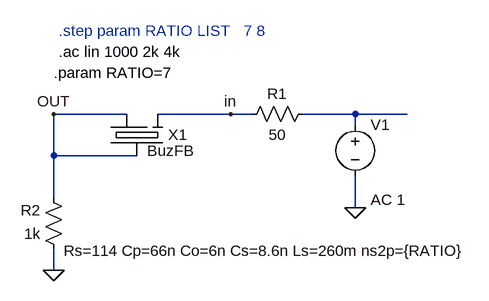
[diagram p0: schematic input_short.asc]
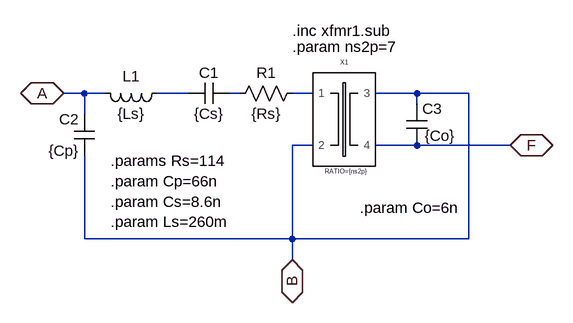
[diagram p1: sub-circuit buzfb.asc]
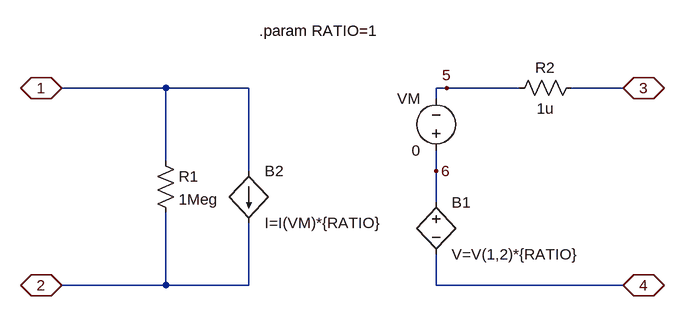
[diagram p2: sub-circuit xmfr1.asc]
input_short.asc, the LTspice schematic file:
Version 4
SHEET 1 3040 2984
WIRE 1712 2608 1600 2608
WIRE 1872 2608 1760 2608
WIRE 1904 2608 1872 2608
WIRE 2064 2608 1984 2608
WIRE 2144 2608 2064 2608
WIRE 2064 2624 2064 2608
WIRE 1600 2672 1600 2608
WIRE 1728 2672 1600 2672
WIRE 1600 2736 1600 2672
WIRE 2064 2752 2064 2704
WIRE 1600 2848 1600 2816
FLAG 1600 2848 0
FLAG 2064 2752 0
FLAG 1600 2608 OUT
FLAG 1872 2608 in
SYMBOL VOLTAGE 2064 2608 R0
WINDOW 123 24 132 Left 2
WINDOW 39 0 0 Left 2
SYMATTR Value2 AC 1
SYMATTR InstName V1
SYMATTR Value ""
SYMBOL res 2000 2592 R90
WINDOW 0 0 56 VBottom 2
WINDOW 3 32 56 VTop 2
SYMATTR InstName R1
SYMATTR Value 50
SYMBOL res 1616 2832 R180
WINDOW 0 36 76 Left 2
WINDOW 3 36 40 Left 2
SYMATTR InstName R2
SYMATTR Value 1k
SYMBOL BuzFB 1728 2640 R0
WINDOW 39 -113 178 Left 2
SYMATTR InstName X1
SYMATTR SpiceLine Rs=114 Cp=66n Co=6n Cs=8.6n Ls=260m ns2p={RATIO}
TEXT 1608 2512 Left 2 !.ac lin 1000 2k 4k
TEXT 1600 2544 Left 2 !.param RATIO=7
TEXT 1608 2480 Left 2 ;.step param RATIO LIST   7 8

buzfb.asc, the sub-circuit schematic file:
Version 4
SHEET 1 880 680
WIRE -144 -48 -176 -48
WIRE -112 -48 -144 -48
WIRE 16 -48 -32 -48
WIRE 96 -48 80 -48
WIRE 208 -48 176 -48
WIRE 368 -48 304 -48
WIRE 448 -48 368 -48
WIRE 368 -32 368 -48
WIRE -144 -16 -144 -48
WIRE 208 32 176 32
WIRE 368 32 304 32
WIRE 512 32 368 32
WIRE -144 176 -144 48
WIRE 176 176 176 32
WIRE 176 176 -144 176
WIRE 448 176 448 -48
WIRE 448 176 176 176
WIRE 176 208 176 176
FLAG 512 32 F
IOPIN 512 32 BiDir
FLAG -176 -48 A
IOPIN -176 -48 BiDir
FLAG 176 208 B
IOPIN 176 208 BiDir
SYMBOL cap -128 48 R180
WINDOW 0 24 56 Left 2
WINDOW 3 24 8 Left 2
SYMATTR InstName C2
SYMATTR Value {Cp}
SYMBOL cap 352 -32 R0
WINDOW 3 28 49 Left 2
SYMATTR Value {Co}
SYMATTR InstName C3
SYMBOL ind -16 -64 R90
WINDOW 0 5 56 VBottom 2
WINDOW 3 32 56 VTop 2
SYMATTR InstName L1
SYMATTR Value {Ls}
SYMBOL res 192 -64 R90
WINDOW 0 0 56 VBottom 2
WINDOW 3 32 56 VTop 2
SYMATTR InstName R1
SYMATTR Value {Rs}
SYMBOL cap 80 -64 R90
WINDOW 0 0 32 VBottom 2
WINDOW 3 32 32 VTop 2
SYMATTR InstName C1
SYMATTR Value {Cs}
SYMBOL XMFR1 256 -16 R0
SYMATTR InstName X1
SYMATTR SpiceLine RATIO={ns2p}
TEXT -104 56 Left 2 !.params Rs=114\n.param Cp=66n\n.param Cs=8.6n\n.param Ls=260m
TEXT 176 -120 Left 2 !.param ns2p=7
TEXT 176 -144 Left 2 !.inc xfmr1.sub
TEXT 280 128 Left 2 !.param Co=6n

xmfr1.asc, the sub-circuit schematic file:
Version 4
SHEET 1 880 680
WIRE 64 -112 -96 -112
WIRE 192 -112 64 -112
WIRE 496 -112 480 -112
WIRE 608 -112 496 -112
WIRE 768 -112 688 -112
WIRE 480 -96 480 -112
WIRE 64 0 64 -112
WIRE 192 16 192 -112
WIRE 480 16 480 -16
WIRE 480 64 480 16
WIRE 64 192 64 80
WIRE 64 192 -96 192
WIRE 192 192 192 96
WIRE 192 192 64 192
WIRE 480 192 480 144
WIRE 768 192 480 192
FLAG -96 -112 1
IOPIN -96 -112 BiDir
FLAG -96 192 2
IOPIN -96 192 BiDir
FLAG 768 -112 3
IOPIN 768 -112 BiDir
FLAG 768 192 4
IOPIN 768 192 BiDir
FLAG 496 -112 5
FLAG 480 16 6
SYMBOL res 48 -16 R0
SYMATTR InstName R1
SYMATTR Value 1Meg
SYMBOL res 704 -128 R90
WINDOW 0 0 56 VBottom 2
WINDOW 3 32 56 VTop 2
SYMATTR InstName R2
SYMATTR Value 1u
SYMBOL voltage 480 0 R180
WINDOW 0 24 96 Left 2
WINDOW 3 24 16 Left 2
WINDOW 123 0 0 Left 0
WINDOW 39 0 0 Left 0
SYMATTR InstName VM
SYMATTR Value 0
SYMBOL bv 480 48 R0
SYMATTR InstName B1
SYMATTR Value V=V(1,2)*{RATIO}
SYMBOL bi 192 16 R0
SYMATTR InstName B2
SYMATTR Value I=I(VM)*{RATIO}
TEXT 208 -200 Left 2 !.param RATIO=1

The netlist it stands for:
* input_short.asc
V1 N001 0 AC 1
R1 N001 in 50
R2 0 OUT 1k
XX1 OUT OUT in buzfb params: BuzFB Rs=114 Cp=66n Co=6n Cs=8.6n Ls=260m ns2p={RATIO}

* block symbol definitions
.subckt buzfb A B F
C2 B A {Cp}
C3 B F {Co}
L1 N001 A {Ls}
R1 N003 N002 {Rs}
C1 N002 N001 {Cs}
XX1 N003 B B F xmfr1 params: RATIO={ns2p}
.params Rs=114
.param Cp=66n
.param Cs=8.6n
.param Ls=260m
.param ns2p=7
.inc xfmr1.sub
.param Co=6n
.ends buzfb

.subckt xmfr1 1 2 3 4
R1 1 2 1Meg
R2 3 5 1u
VM 6 5 0
B1 6 4 V=V(1,2)*{RATIO}
B2 1 2 I=I(VM)*{RATIO}
.param RATIO=1
.ends xmfr1

.ac lin 1000 2k 4k
.param RATIO=7
* .step param RATIO LIST   7 8
.backanno
.end